# Altium schematic sheet PV Header.SchDoc: Hyperion Solar Panel Header
size Letter; SheetNumber: 18; SheetTotal: 18
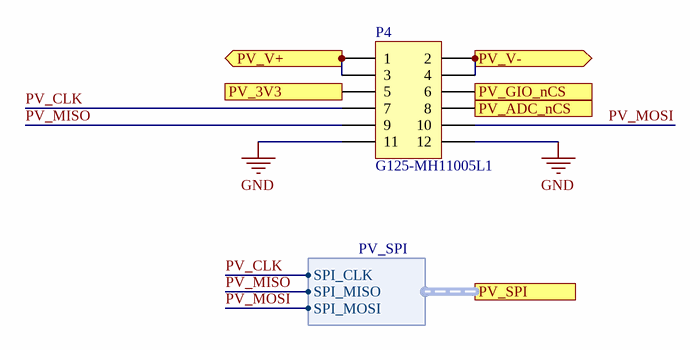
[diagram p0: PV Header.SchDoc]

## Parts
P4  G125-MH11005L1  [HWN-G125-MH11005L1]

## Ports
PV_3V3 (out), PV_ADC_nCS (out), PV_GIO_nCS (out), PV_SPI (harness PV_SPI), PV_V+ (out), PV_V- (out)

## Harnesses
PV_SPI: SPI_CLK, SPI_MISO, SPI_MOSI

## Nets
GND: P4.11 P4.12
PV_3V3: P4.5 ; port PV_3V3
PV_ADC_nCS: P4.8 ; port PV_ADC_nCS
PV_CLK: P4.7 ; port PV_SPI.SPI_CLK
PV_GIO_nCS: P4.6 ; port PV_GIO_nCS
PV_MISO: P4.9 ; port PV_SPI.SPI_MISO
PV_MOSI: P4.10 ; port PV_SPI.SPI_MOSI
PV_V+: P4.1 P4.3 ; port PV_V+
PV_V-: P4.2 P4.4 ; port PV_V-

## Notes on the sheet
- (the "License"); you may not use or redistribute this file except in compliance with the License. You
- This file and the information within it are licensed under the terms of the Apache License, Version 2.0
- Copyright
- Unless required by applicable law or agreed to in writing, content distributed under the License is
- distributed on an "AS IS" BASIS, WITHOUT WARRANTIES OR CONDITIONS OF ANY KIND,
- either express or implied. See the License for the specific language governing permissions and
- limitations under the License.
- may obtain a copy of the License at:
- http://www.apache.org/licenses/LICENSE-2.0
- Title
- Size:
- Date:
- Letter
- Number:
- Time:
- Revision:
- Sheet
- of
- University of Alberta
- Deptartment of Electrical
- and Computer Engineering
- Edmonton AB, Canada
- T6G 1H9
- File:

## Library data of the parts
P4 = PP-HWN-00015: CONN HEADER R/A 10POS 1.25MM; Manufacturer Part Number: G125-MH11005L1P; Index: 15; LatestRevisionDate: 2019-07-08; LatestRevisionNote: ...; Publisher: AlbertaSat; Part Number: PP-HWN-00015; Supplier Part Number 1: 952-2696-ND; Supplier 1: Digi-key; Supplier Part Number 2: 855-G125-MH11005L1P; Supplier 2: Mouser; Published: 2019-07-08; Supplier Link: https://www.digikey.ca/products/en?keywords=952-2696-ND